# Altium schematic sheet LM3404HV_Circuit.SchDoc
size A
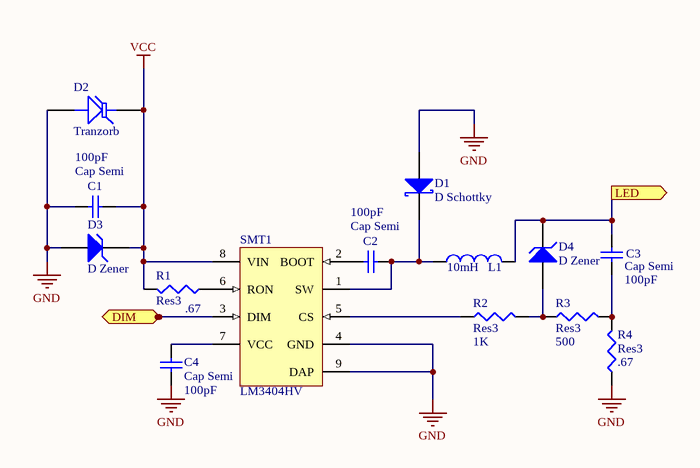
[diagram p0: LM3404HV_Circuit.SchDoc]

## Parts
C1  Cap Semi  value 100pF  [1608[0603]]
C2  Cap Semi  value 100pF  [1608[0603]]
C3  Cap Semi  value 100pF  [1608[0603]]
C4  Cap Semi  value 100pF  [1608[0603]]
D1  D Schottky  [DIODE-0.4]
D2  Tranzorb  [DO-7]
D3  D Zener  [DIODE-0.7]
D4  D Zener  [DIODE-0.7]
L1  value 10mH  [0603]  (hidden comment: Inductor)
R1  Res3  value .67  [J1-0603]
R2  Res3  value 1K  [J1-0603]
R3  Res3  value 500  [J1-0603]
R4  Res3  value .67  [J1-0603]
SMT1  LM3404HV  [MRA08B_M]

## Ports
DIM (in), LED (out)

## Nets
GND: C1.1 C4.1 D1.1(A) D2.1(A) D3.1(A) R4.1 SMT1.4(GND) SMT1.9(DAP)
VCC: C1.2 D2.2(K) D3.2(K) R1.2 SMT1.8(VIN)
DIM: SMT1.3(DIM) ; port DIM
LED: C3.2 D4.2(K) L1.2 ; port LED
NetC2_1: C2.1 SMT1.2(BOOT)
NetC2_2: C2.2 D1.2(K) L1.1 SMT1.1(SW)
NetC3_1: C3.1 R3.2 R4.2
NetC4_2: C4.2 SMT1.7(VCC)
NetD4_1: D4.1(A) R2.2 R3.1
NetR1_1: R1.1 SMT1.6(RON)
NetR2_1: R2.1 SMT1.5(CS)

## Library data of the parts
C1-C4 = Cap Semi: Capacitor (Semiconductor SIM Model); Published: 8-Jun-2000; LatestRevisionDate: 29-May-2009; LatestRevisionNote: IPC-7351 Footprint Added.; PackageReference: C1206; Publisher: Altium Limited; PackageDescription: Chip Capacitor
D1 = D Schottky: Schottky Diode; Published: 8-Jun-2000; LatestRevisionDate: 17-Jul-2002; LatestRevisionNote: Re-released for DXP Platform.; PackageReference: SMB; Publisher: Altium Limited; PackageDescription: DO-214-AA/SMB; 2 C-Bend Leads; Body 5.3 x 3.6 mm, inc. leads (LxW); Code_JEDEC: DO-214-AA
D2 = Tranzorb: Transient Voltage Suppression (TVS) Diode; Published: 24-Mar-1999; LatestRevisionDate: 17-Jul-2002; LatestRevisionNote: Re-released for DXP Platform.; PackageReference: DO-7; Publisher: Altium Limited; PackageDescription: Axial Lead Diode
D3 D4 = D Zener: Zener Diode; Published: 8-Jun-2000; LatestRevisionDate: 17-Jul-2002; LatestRevisionNote: Re-released for DXP Platform.; PackageReference: DIODE-0.7; Publisher: Altium Limited; PackageDescription: Diode, Thru-Hole; 2 Leads; 0.7 in Pin Spacing
L1 = Inductor: Code_IEC: 1005; Published: 8-Jun-2000; LatestRevisionDate: 29-May-2009; LatestRevisionNote: IPC-7351 Footprint Added.; PackageReference: 0402-A; Publisher: Altium Limited; PackageDescription: Chip Inductor; Code_JEITA: 0402
R1-R4 = Res3: Resistor; Published: 8-Jun-2000; LatestRevisionDate: 29-May-2009; LatestRevisionNote: IPC-7351 Footprint Added.; PackageReference: J1-0603; Publisher: Altium Limited; PackageDescription: Chip Resistor
SMT1 = LM3404HVMR/NOPB: 1.0A Constant Current Buck Regulator for High Power LED Drivers, 8-pin PSOP, Pb-Free; Manufacturer: National Semiconductor; PackageTopMarking: NSXYTT*L3404*HVMR; PowerWise: Y; CompType: MiscPower; Published: 1-Mar-2010; DatasheetVersion: Jun-2007; PackageVersion: revB, Dec-2007; PackageReference: MRA08B; Publisher: Altium Limited; PackageDescription: Molded, PSOP .193 x .154 x .058in, 8 Lead, .050in Pitch, Large DAP; Supplier 1: Digi-Key; Supplier Part Number 1: LM3404HVMR-ND; Supplier 2: Farnell; Supplier Part Number 2: 1364354; PartNumber: LM3404HVMR/NOPB; RoHS: Y; PinCount: 8; Code_JEDEC: MS-012-AA; ComponentLink1Description: LM3404HV Datasheet; ComponentLink1URL: http://www.national.com/ds/LM/LM3404HV.pdf; ComponentLink2Description: LM3404HV Web Page; ComponentLink2URL: http://www.national.com/pf/LM/LM3404HV.html; ComponentLink3Description: MRA08B Package Page; ComponentLink3URL: http://www.national.com/packaging/folders/mra08b.html